# Altium schematic sheet SeccionHimfu.SchDoc
size A4
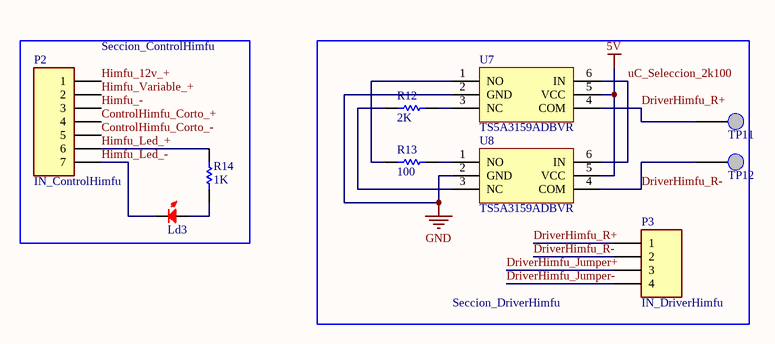
[diagram p0: SeccionHimfu.SchDoc]

## Parts
Ld3  PinesParaLed  [Jumper-Simple]  (value not drawn)
P2  IN_ControlHimfu  [B7B-XH-A_3D]
P3  IN_DriverHimfu  [B4B-XH-A_3D]
R12  2K  [R_0805]
R13  100  [R_0805]
R14  1K  [R_0805]
TP11  DRH+  [TP-5002]  (value not drawn)
TP12  DRH-  [TP-5002]  (value not drawn)
U7  TS5A3159ADBVR  [SOT23-6]
U8  TS5A3159ADBVR  [SOT23-6]

## Blocks framed on the sheet
Seccion_ControlHimfu: Ld3 P2 R14
Seccion_DriverHimfu: P3 R12 R13 TP11 TP12 U7 U8

## Nets
5V: U7.5(VCC) U8.5(VCC)
GND: U7.2(GND) U8.2(GND)
ControlHimfu_Corto_+: P2.4
ControlHimfu_Corto_-: P2.5
DriverHimfu_Jumper+: P3.3
DriverHimfu_Jumper-: P3.4
DriverHimfu_R+: P3.1 TP11.1 U7.4(COM)
DriverHimfu_R-: P3.2 TP12.1 U8.4(COM)
Himfu_12v_+: P2.1
Himfu_-: P2.3
Himfu_Led_+: P2.6 R14.2
Himfu_Led_-: Ld3.2 P2.7
Himfu_Variable_+: P2.2
uC_Seleccion_2k100: U7.6(IN) U8.6(IN)
NetLd3_1: Ld3.1 R14.1
NetR12_1: R12.1 U8.3(NC)
NetR12_2: R12.2 U7.3(NC)
NetR13_1: R13.1 U7.1(NO)
NetR13_2: R13.2 U8.1(NO)

## Library data of the parts
Ld3 = PinesParaLed: CONN HEADER 2 POS 2.54; Cod.Fabricante: 61300211121; Fabricante: Wurth Electronics Inc.; Cod.DigiKey: 732-5315-ND; ComponentLink1Description: Manufacturer Link; ComponentLink1URL: https://katalog.we-online.de/em/datasheet/6130xx11121.pdf; ComponentLink2Description: Datasheet; ComponentLink2URL: *; DatasheetVersion: *; DIGIKEYx100: 0.06700; LatestRevisionDate: *; LatestRevisionNote: *; PackageDescription: *; PackageReference: *; PackageVersion: *; Published: 29-sep-00; Publisher: Altium Limited; Value: *
P2 = JST_2.5_7: CONN HEADER XH TOP 7POS 2.5MM; Cod.Fabricante: B7B-XH-A(LF)(SN); Fabricante: JST Sales America Inc.; LatestRevisionDate: 17-Jul-2002; LatestRevisionNote: Re-released for DXP Platform.; Publisher: Altium Limited; Cod.Digikey: 455-2252-ND; ComponentLink2Description: Datasheet; ComponentLink2URL: http://www.jst-mfg.com/product/pdf/eng/eXH.pdf; DIGIKEYx100: 0.2156
P3 = JST_2.5_4: CONN HEADER XH TOP 4POS 2.5MM; Cod.Fabricante: B4B-XH-A(LF)(SN); Fabricante: JST Sales America Inc.; LatestRevisionDate: 17-Jul-2002; LatestRevisionNote: Re-released for DXP Platform.; Publisher: Altium Limited; Cod.Digikey: 455-2249-ND; ComponentLink2Description: Datasheet; ComponentLink2URL: http://www.jst-mfg.com/product/pdf/eng/eXH.pdf; DIGIKEYx100: 0.1348
R12 = R_2k: RES SMD 2K OHM 1% 1/8W 0805; Cod.Fabricante: RC0805FR-072KL; Fabricante: Yageo; Published: 8-Jun-2000; LatestRevisionDate: 17-Jul-2002; LatestRevisionNote: Re-released for DXP Platform.; PackageReference: 0805; Publisher: Altium Limited; Cod.Digikey: 311-2.00KCRCT-ND; Value: 2K; DIGIKEYx100: 0.01630
R13 = R_100: RES SMD 100 OHM 1% 1/8W 0805; Cod.Fabricante: RC0805FR-07100RL; Fabricante: Yageo; Published: 8-Jun-2000; LatestRevisionDate: 17-Jul-2002; LatestRevisionNote: Re-released for DXP Platform.; PackageReference: 0805; Publisher: Altium Limited; Cod.Digikey: 311-100CRCT-ND; Value: 100; DIGIKEYx100: 0.01630
R14 = R_1k: RES SMD 1K OHM 1% 1/8W 0805; Cod.Fabricante: RC0805FR-071KL; Fabricante: Yageo; Published: 8-Jun-2000; LatestRevisionDate: 17-Jul-2002; LatestRevisionNote: Re-released for DXP Platform.; PackageReference: 0805; Publisher: Altium Limited; Cod.Digikey: 311-1.00KCRCT-ND; Value: 1K; DIGIKEYx100: 0.01630
TP11 TP12 = TestPoint: White PC Test Point, Miniature Phosphor Bronze, Silver Plating 0.040" (1.02mm) Hole Diameter Mounting Type; Cod.Fabricante: 5002; Fabricante: Keystone Electronics; Cod.DigiKey: 36-5002-ND; ComponentLink1Description: Manufacturer Link; ComponentLink1URL: http://www.keyelco.com/product-pdf.cfm?p=1311; ComponentLink2Description: Datasheet; ComponentLink2URL: *; DatasheetVersion: *; DIGIKEYx100: 0.22090; LatestRevisionDate: *; LatestRevisionNote: *; PackageDescription: *; PackageReference: *; PackageVersion: *; Published: 29-sep-00; Publisher: Altium Limited; Value: *
U7 U8 = TS5A3159ADBVR: IC SWITCH SPDT SOT23-6; Fabricante: Texas Instruments; Cod.DigiKey: 296-19265-1-ND; Cod.Fabricante: TS5A3159ADBVR; ComponentLink1Description: Manufacturer Link; ComponentLink1URL: TS5A3159ADBVR; ComponentLink2Description: Datasheet; ComponentLink2URL: *; DatasheetVersion: F; DIGIKEYx100: 0.55690; LatestRevisionDate: *; LatestRevisionNote: *; PackageDescription: SOT-23-6; PackageReference: SOT-23-6; PackageVersion: *; Published: 29-sep-00; Publisher: Altium Limited; Value: TS5A3159ADBVR